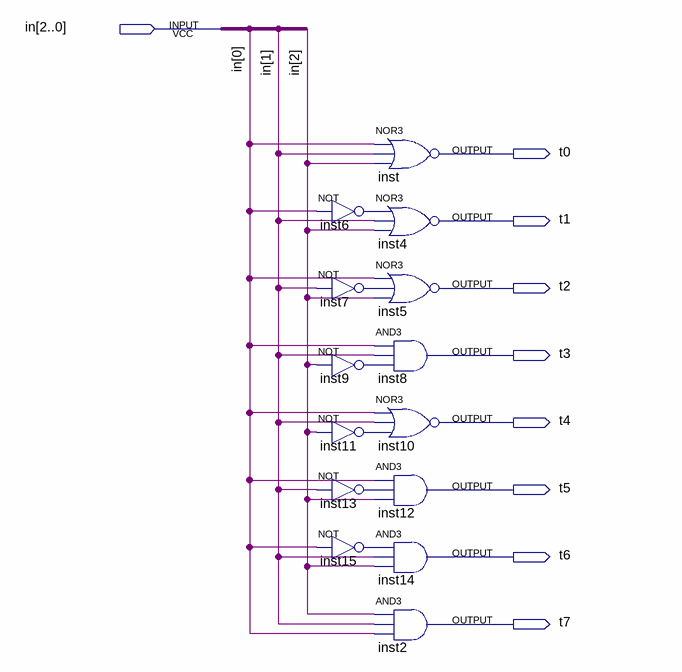
[diagram p0: schematic sheet]
// Quartus schematic temporizador.bdf as structural Verilog: 14 symbols, 9 pins
module temporizador (
  input  [2:0] in,
  output t0,
  output t1,
  output t2,
  output t3,
  output t4,
  output t5,
  output t6,
  output t7
);

  wire inst6_out, inst7_out, inst9_out, inst11_out, inst13_out, inst15_out;

  not inst6 (inst6_out, in[0]);
  not inst7 (inst7_out, in[1]);
  not inst9 (inst9_out, in[2]);
  not inst11 (inst11_out, in[2]);
  not inst13 (inst13_out, in[1]);
  not inst15 (inst15_out, in[0]);
  nor inst (t0, in[0], in[1], in[2]);
  nor inst4 (t1, inst6_out, in[1], in[2]);
  nor inst5 (t2, in[0], inst7_out, in[2]);
  and inst8 (t3, in[0], in[1], inst9_out);
  nor inst10 (t4, in[0], in[1], inst11_out);
  and inst12 (t5, in[0], inst13_out, in[2]);
  and inst14 (t6, inst15_out, in[1], in[2]);
  and inst2 (t7, in[2], in[1], in[0]);
endmodule
